# EAGLE design jtag-8pinAdapter (EAGLE 4.16)
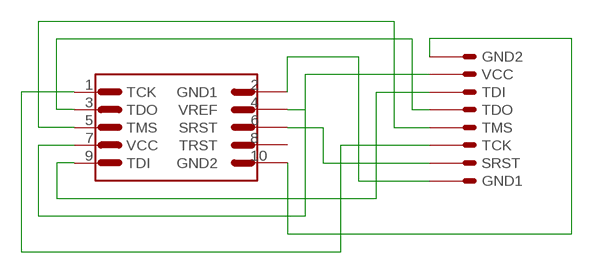
[diagram p0: schematic, sheet 1]

## Parts
U$1  AJTG_10P100_MIL  [MA05-2]
U$2  JTAG_8P_2X4  [HEADER2X4_50]

## Nets
GND1: U$1.2(GND1) U$2.GND1
GND2: U$1.10(GND2) U$2.GND2
SRST: U$1.6(SRST) U$2.SRST
TCK: U$1.1(TCK) U$2.TCK
TDI: U$1.9(TDI) U$2.TDI
TDO: U$1.3(TDO) U$2.TDO
TMS: U$1.5(TMS) U$2.TMS
VCC: U$1.4(VREF) U$1.7(VCC) U$2.VCC
Unconnected: U$1.8(TRST)

## Library data of the parts
U$1 = ATMEL:AJTG_10P
U$2 = ATMEL:JTAG_8P_

## Board
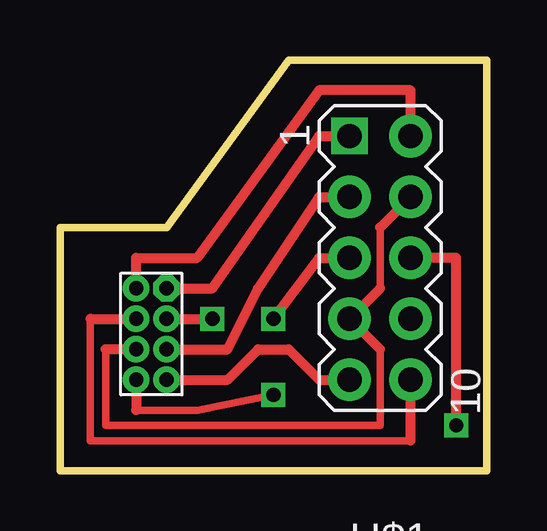
[diagram p1: board, top side]
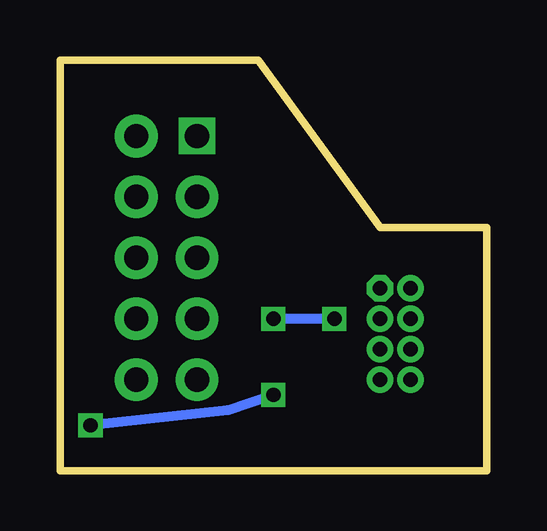
[diagram p2: board, bottom side, seen from below]

Size 17.78 x 17.14 mm. Coordinates in mm from the lower left corner, seen from the top.
Outline: 17.78,17.14 9.53,17.14 4.45,10.16 0,10.16 0,0 17.78,0 17.78,17.14
Copper layers (1*2+15*16): Top 0.035mm / dielectric 0.2mm / Route2 0.035mm / dielectric 0.15mm / Route15 0.035mm / dielectric 0.2mm / Bottom 0.035mm
Design rules "default": minimum track width 10mil, minimum drill 24mil, track to track 8mil, track to pad 8mil, pad to pad 8mil, via to via 8mil, smd to smd 8mil, copper to edge 40mil, drill to drill 8mil, minimum pad ring 10mil, minimum via ring 8mil, stop-mask expansion 4mil, vias tented up to drill 0mil, thermal gap 10mil

### Footprints (pad centres in the part's own frame; a part is rotated, then mirrored left to right if it is on the bottom)
MA05-2 = drill 1.016 square: 1 -5.08,-1.27 | drill 1.016 pad 1.778 round: 2 -5.08,1.27; 3 -2.54,-1.27; 4 -2.54,1.27; 5 0,-1.27; 6 0,1.27; 7 2.54,-1.27; 8 2.54,1.27; 9 5.08,-1.27; 10 5.08,1.27
HEADER2X4_50 = drill 0.6 pad 0.813 round: GND1 0,0; SRST 3.81,0; TMS 1.27,1.27; VCC 2.54,0 | drill 0.6 pad 1.016 round: GND2 1.27,0; TDI 3.81,1.27; TDO 2.54,1.27 | drill 0.6 pad 0.813 octagon: TCK 0,1.27

### Placement (x,y rotation side)
U$1  13.33,8.89 270 top
U$2  3.17,7.62 270 top

### Tracks (layer width: path | path; a pad name or v marks a point on that pad's centre or on a via)
GND1
  Top 0.406: U$2.GND1 3.17,8.89 5.71,8.89 10.79,15.88 14.61,15.88 U$1.2
GND2
  Top 0.305: 14.61,1.27 1.27,1.27 1.27,6.35
  Top 0.406: 14.61,1.27 U$1.10 | 1.27,6.35 U$2.GND2
SRST  (via drill 0.6)
  Top 0.305: 3.17,2.54 5.71,2.54 v8.89,3.17
  Top 0.406: U$2.SRST 3.17,2.54 | v16.51,1.91 16.51,8.89 U$1.6
  Bottom 0.406: v8.89,3.17 10.79,2.54 v16.51,1.91
TCK
  Top 0.406: U$2.TCK 6.35,7.62 10.79,13.97 U$1.1
TDI
  Top 0.406: U$2.TDI 6.98,3.81 8.26,5.08 9.53,5.08 10.79,3.81 U$1.9
TDO
  Top 0.406: U$1.3 10.79,11.43 8.26,7.62 6.98,5.08 U$2.TDO
TMS  (via drill 0.6)
  Top 0.406: U$2.TMS v6.35,6.35 | v8.89,6.35 10.79,8.89 U$1.5
  Bottom 0.406: v6.35,6.35 v8.89,6.35
VCC
  Top 0.305: 13.33,7.62 13.33,10.16 | 1.91,5.08 1.91,1.91 13.33,1.91 13.33,5.08
  Top 0.406: 13.33,10.16 U$1.4 | 13.33,7.62 U$1.7 13.33,5.08 | U$2.VCC 1.91,5.08